# EAGLE design modEEGamp_v1.1 (EAGLE 4.09)
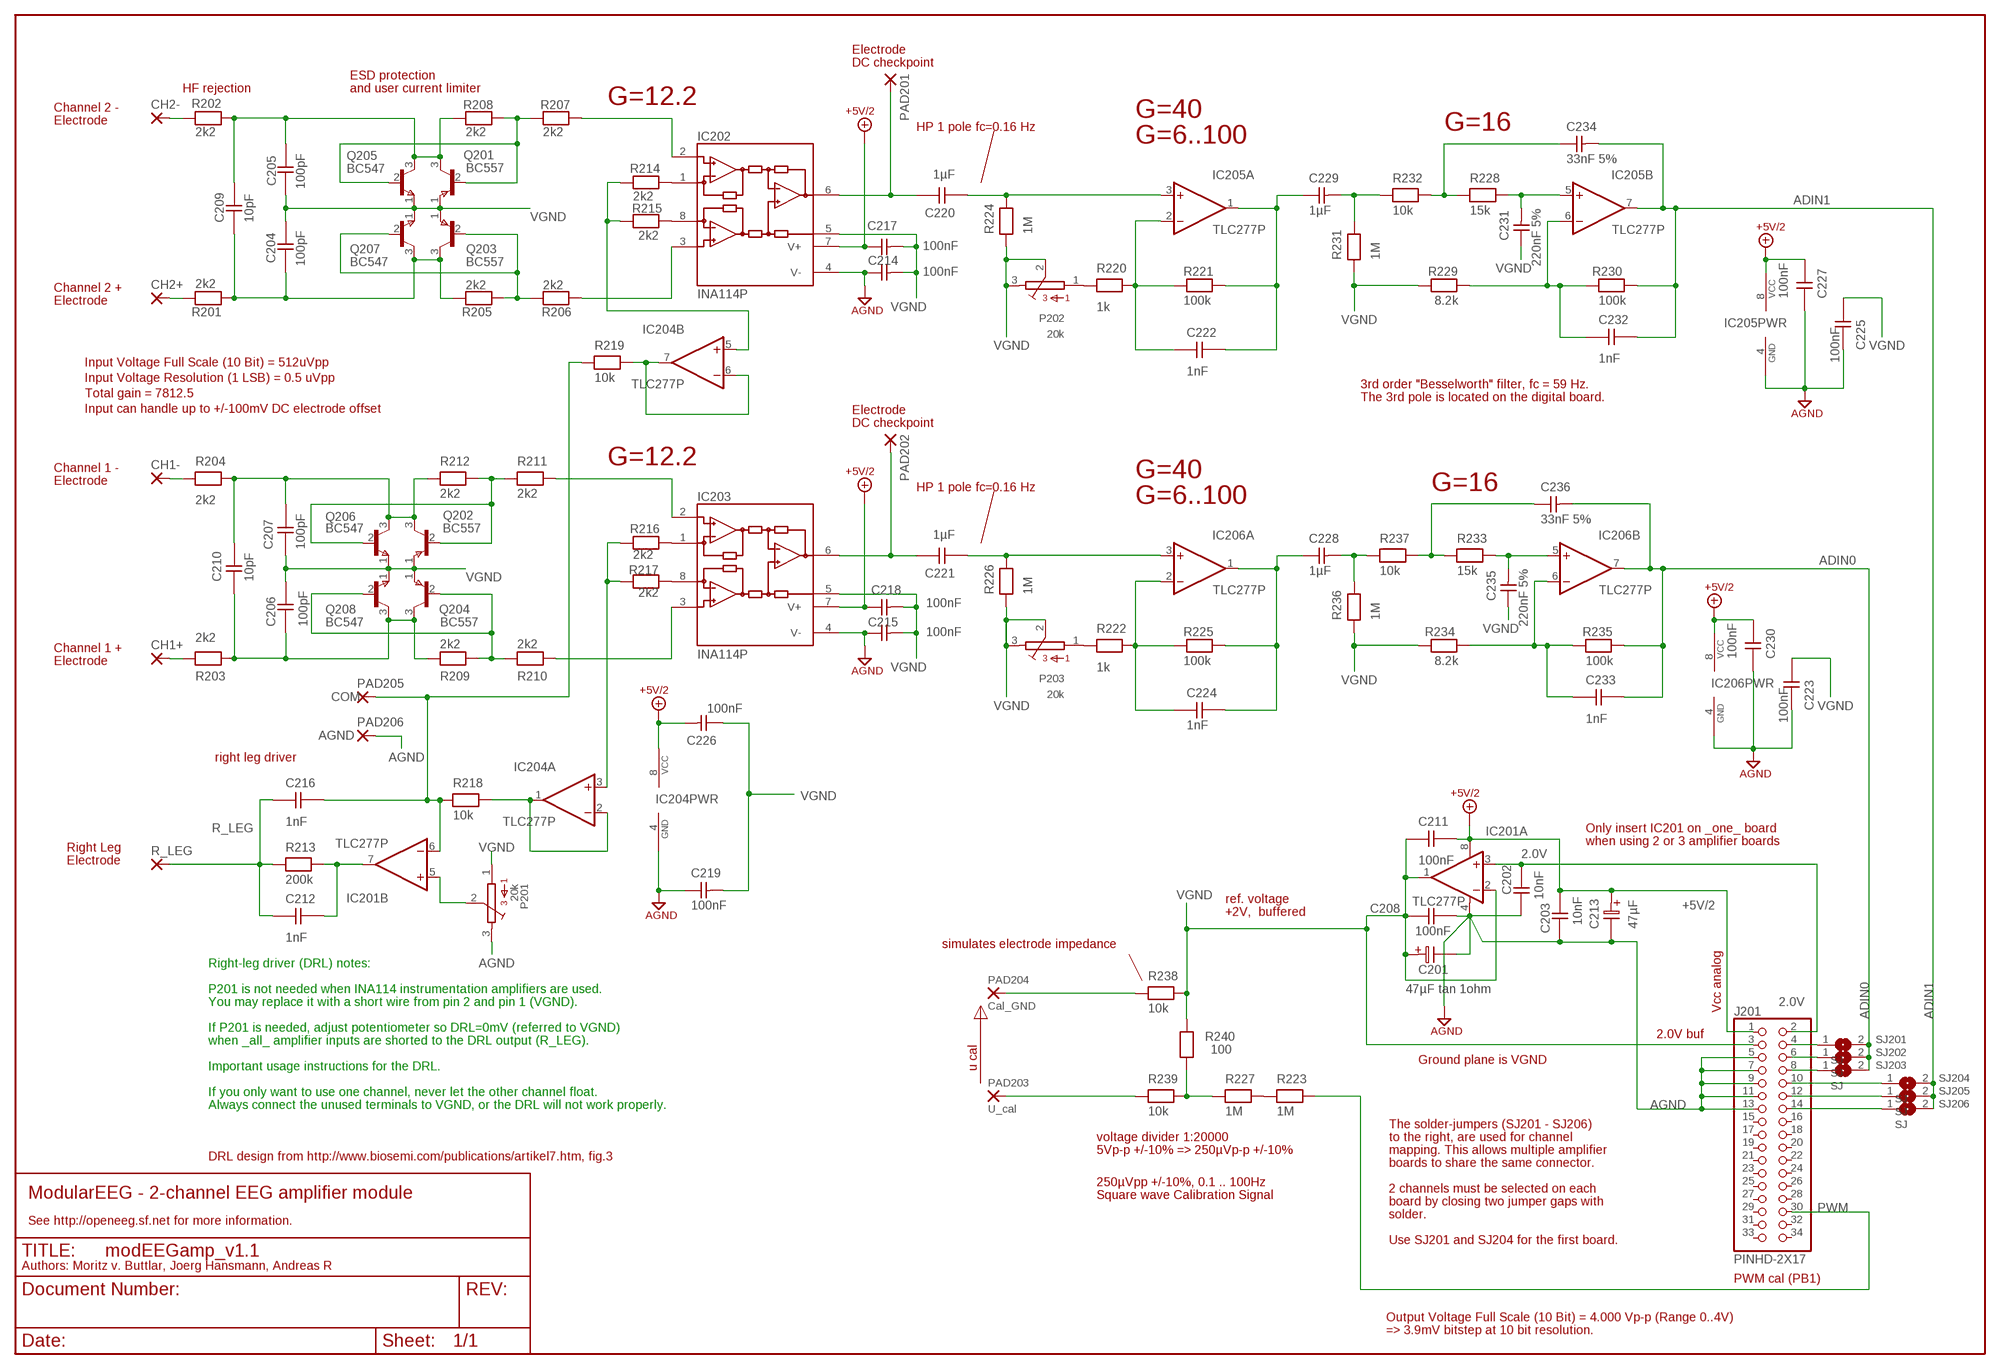
[diagram p0: schematic, sheet 1]

## Parts
C201  47µF tan 1ohm  ELC-2,5  [EL25B]
C202  10nF  CAPNP-5@2  [C-5]
C203  10nF  CAPNP-7,5  [C-5]
C204  100pF  CAPNP-7,5  [C-5]
C205  100pF  CAPNP-7,5  [C-5]
C206  100pF  CAPNP-7,5  [C-5]
C207  100pF  CAPNP-7,5  [C-5]
C208  100nF  CAPNP-7,5  [C-5]
C209  10pF  CAPNP-7,5  [C-5]
C210  10pF  CAPNP-7,5  [C-5]
C211  100nF  CAPNP-5@2  [C-5]
C212  1nF  CAPNP-7,5  [C-5]
C213  47µF  ELC-5  [EL25B]
C214  100nF  CAPNP-5  [C-5]
C215  100nF  CAPNP-5  [C-5]
C216  1nF  CAPNP-7,5  [C-5]
C217  100nF  CAPNP-5  [C-5]
C218  100nF  CAPNP-5  [C-5]
C219  100nF  CAPNP-5  [C-5]
C220  1µF  CAPNP-7,5@2  [C-10]
C221  1µF  CAPNP-7,5@2  [C-10]
C222  1nF  CAPNP-7,5  [C-5]
C223  100nF  CAPNP-5@2  [C-5]
C224  1nF  CAPNP-7,5  [C-5]
C225  100nF  CAPNP-5@2  [C-5]
C226  100nF  CAPNP-5  [C-5]
C227  100nF  CAPNP-5@2  [C-5]
C228  1µF  CAPNP-7,5@3  [C-10]
C229  1µF  CAPNP-7,5@3  [C-10]
C230  100nF  CAPNP-5@2  [C-5]
C231  220nF 5%  CAPNP-5  [C-5]
C232  1nF  CAPNP-7,5  [C-5]
C233  1nF  CAPNP-7,5  [C-5]
C234  33nF 5%  CAPNP-5  [C-5]
C235  220nF 5%  CAPNP-5  [C-5]
C236  33nF 5%  CAPNP-5  [C-5]
CH1+  1,6/0,8  [1,6/0,8]
CH1-  1,6/0,8  [1,6/0,8]
CH2+  1,6/0,8  [1,6/0,8]
CH2-  1,6/0,8  [1,6/0,8]
IC201  TLC277P  OPA2604AP  [DIL-08]
IC202  INA114P  [DIL-08]
IC203  INA114P  [DIL-08]
IC204  TLC277P  [DIL-08]
IC205  TLC277P  [DIL-08]
IC206  TLC277P  [DIL-08]
J201  PINHD-2X17  [2X17]
P201  20k  S64Y  [S64Y]
P202  20k  S64Y  [S64Y]
P203  20k  S64Y  [S64Y]
PAD201  1,6/0,8  [1,6/0,8]
PAD202  1,6/0,8  [1,6/0,8]
PAD203  U_cal  1,6/0,8  [WIREPAD1]
PAD204  Cal_GND  1,6/0,8  [WIREPAD1]
PAD205  COM  1,6/0,8  [1,6/0,8]
PAD206  AGND  1,6/0,8  [1,6/0,8]
Q201  BC557  [TO92]
Q202  BC557  [TO92]
Q203  BC557  [TO92]
Q204  BC557  [TO92]
Q205  BC547  [TO92]
Q206  BC547  [TO92]
Q207  BC547  [TO92]
Q208  BC547  [TO92]
R201  2k2  RESEU-10  [R-10]
R202  2k2  RESEU-10  [R-10]
R203  2k2  RESEU-10  [R-10]
R204  2k2  RESEU-10  [R-10]
R205  2k2  RESEU-10  [R-10]
R206  2k2  RESEU-10  [R-10]
R207  2k2  RESEU-10  [R-10]
R208  2k2  RESEU-10  [R-10]
R209  2k2  RESEU-10  [R-10]
R210  2k2  RESEU-10  [R-10]
R211  2k2  RESEU-10  [R-10]
R212  2k2  RESEU-10  [R-10]
R213  200k  RESEU-10  [R-10]
R214  2k2  RESEU-7,5  [R-10]
R215  2k2  RESEU-7,5  [R-10]
R216  2k2  RESEU-7,5  [R-10]
R217  2k2  RESEU-7,5  [R-10]
R218  10k  RESEU-10  [R-10]
R219  10k  RESEU-10@2  [R-10]
R220  1k  RESEU-7,5  [R-10]
R221  100k  RESEU-7,5  [R-10]
R222  1k  RESEU-7,5  [R-10]
R223  1M  RESEU-10@2  [R-10]
R224  1M  RESEU-7,5  [R-10]
R225  100k  RESEU-7,5  [R-10]
R226  1M  RESEU-7,5  [R-10]
R227  1M  RESEU-10@2  [R-10]
R228  15k  RESEU-7,5@2  [R-10]
R229  8.2k  RESEU-7,5  [R-10]
R230  100k  RESEU-7,5  [R-10]
R231  1M  RESEU-7,5  [R-10]
R232  10k  RESEU-7,5@2  [R-10]
R233  15k  RESEU-7,5@2  [R-10]
R234  8.2k  RESEU-7,5  [R-10]
R235  100k  RESEU-7,5  [R-10]
R236  1M  RESEU-7,5  [R-10]
R237  10k  RESEU-7,5@2  [R-10]
R238  10k  RESEU-7,5  [R-10]
R239  10k  RESEU-7,5  [R-10]
R240  100  RESEU-7,5  [R-10]
R_LEG  1,6/0,8  [1,6/0,8]
SJ201  SJ  [SJ5X5]
SJ202  SJ  [SJ5X5]
SJ203  SJ  [SJ5X5]
SJ204  SJ  [SJ5X5]
SJ205  SJ  [SJ5X5]
SJ206  SJ  [SJ5X5]

## Nets
2.0V: C202.1 IC201.3(A:+IN) J201.2
+5V/2: C203.1 C211.2 C213.1 C217.1 C218.1 C226.2 C227.2 C230.2 IC201.8(A:V+) IC202.7(V+) IC203.7(V+) IC204.8(PWR:VCC) IC205.8(PWR:VCC) IC206.8(PWR:VCC) J201.1
ADIN0: C233.2 C236.2 IC206.7(B:OUT) R235.2 SJ201.2 SJ202.2 SJ203.2
ADIN1: C232.2 C234.2 IC205.7(B:OUT) R230.2 SJ204.2 SJ205.2 SJ206.2
AGND: C201.2 C202.2 C203.2 C208.2 C213.2 C214.1 C215.1 C219.1 C223.1 C225.1 C227.1 C230.1 IC201.4(A:V-) IC202.4(V-) IC203.4(V-) IC204.4(PWR:GND) IC205.4(PWR:GND) IC206.4(PWR:GND) J201.5 J201.7 J201.9 J201.11 J201.13 P201.3 PAD206.1(P)
N$1: IC202.1(RG) R214.1
N$2: IC202.8(RG) R215.1
N$3: IC204.5(B:+IN) R214.2 R215.2
N$4: C220.2 IC202.6(OUT) PAD201.1(P)
N$5: IC202.2(-IN) R207.2
N$6: CH1-.1(P) R204.1
N$7: IC202.3(+IN) R206.2
N$8: Q201.2(B) Q205.2(B) R207.1 R208.2
N$9: C205.2 C209.2 Q201.3(C) Q205.3(C) R202.2 R208.1
N$10: Q203.2(B) Q207.2(B) R205.2 R206.1
N$11: CH1+.1(P) R203.1
N$12: IC204.3(A:+IN) R216.2 R217.2
N$13: C204.1 C209.1 Q203.3(C) Q207.3(C) R201.2 R205.1
N$14: IC203.1(RG) R216.1
N$15: CH2-.1(P) R202.1
N$16: CH2+.1(P) R201.1
N$17: C220.1 IC205.3(A:+IN) R224.2
N$18: C222.1 IC205.2(A:-IN) R220.2 R221.1
N$19: P202.1 R220.1
N$20: IC203.8(RG) R217.1
N$21: IC203.2(-IN) R211.2
N$22: C222.2 C229.1 IC205.1(A:OUT) R221.2
N$23: C229.2 R231.2 R232.1
N$24: C232.1 IC205.6(B:-IN) R229.2 R230.1
N$25: C221.2 IC203.6(OUT) PAD202.1(P)
N$26: J201.4 SJ201.1
N$27: IC203.3(+IN) R210.2
N$28: C221.1 IC206.3(A:+IN) R226.2
N$29: Q202.2(B) Q206.2(B) R211.1 R212.2
N$30: PAD204.1(P) R238.1
N$31: J201.6 SJ202.1
N$32: C207.2 C210.2 Q202.3(C) Q206.3(C) R204.2 R212.1
N$33: C212.2 IC201.7(B:OUT) R213.2
N$34: R227.1 R239.2 R240.2
N$35: J201.8 SJ203.1
N$36: J201.10 SJ204.1
N$37: J201.12 SJ205.1
N$38: C224.1 IC206.2(A:-IN) R222.2 R225.1
N$39: Q204.2(B) Q208.2(B) R209.2 R210.1
N$40: P203.1 R222.1
N$41: C216.2 IC201.6(B:-IN) PAD205.1(P) R218.1 R219.1
N$42: C224.2 C228.1 IC206.1(A:OUT) R225.2
N$43: C206.1 C210.1 Q204.3(C) Q208.3(C) R203.2 R209.1
N$44: J201.14 SJ206.1
N$45: IC204.6(B:-IN) IC204.7(B:OUT) R219.2
N$46: R223.1 R227.2
N$47: IC201.5(B:+IN) P201.2
N$48: PAD203.1(P) R239.1
N$49: C233.1 IC206.6(B:-IN) R234.2 R235.1
N$50: C228.2 R236.2 R237.1
N$51: C236.1 R233.1 R237.2
N$52: IC204.1(A:OUT) IC204.2(A:-IN) R218.2
N$53: C234.1 R228.1 R232.2
N$54: C231.2 IC205.5(B:+IN) R228.2
N$57: C235.2 IC206.5(B:+IN) R233.2
PWM: J201.30 R223.2
R_LEG: C212.1 C216.1 R213.1 R_LEG.1(P)
VGND: C201.1 C204.2 C205.1 C206.2 C207.1 C208.1 C211.1 C214.2 C215.2 C217.2 C218.2 C219.2 C223.2 C225.2 C226.1 C231.1 C235.1 IC201.1(A:OUT) IC201.2(A:-IN) IC202.5(REF) IC203.5(REF) J201.3 P201.1 P202.2 P202.3 P203.2 P203.3 Q201.1(E) Q202.1(E) Q203.1(E) Q204.1(E) Q205.1(E) Q206.1(E) Q207.1(E) Q208.1(E) R224.1 R226.1 R229.1 R231.1 R234.1 R236.1 R238.2 R240.1
Unconnected: J201.15 J201.16 J201.17 J201.18 J201.19 J201.20 J201.21 J201.22 J201.23 J201.24 J201.25 J201.26 J201.27 J201.28 J201.29 J201.31 J201.32 J201.33 J201.34

## Notes on the sheet
- Electrode
- DC checkpoint
- ESD protection
- HF rejection | and user current limiter
- G=12.2
- Channel 2 -
- G=40
- Electrode
- HP 1 pole fc=0.16 Hz | G=16
- G=6..100
- Channel 2 +
- Electrode
- Input Voltage Full Scale (10 Bit) = 512uVpp
- Input Voltage Resolution (1 LSB) = 0.5 uVpp
- 3rd order "Besselworth" filter, fc = 59 Hz.
- Total gain = 7812.5
- The 3rd pole is located on the digital board.
- Input can handle up to +/-100mV DC electrode offset | Electrode
- DC checkpoint
- G=12.2
- Channel 1 -
- G=40
- Electrode
- HP 1 pole fc=0.16 Hz | G=16
- G=6..100
- Channel 1 +
- Electrode
- right leg driver
- Only insert IC201 on _one_ board
- when using 2 or 3 amplifier boards
- Right Leg
- Electrode
- ref. voltage
- +2V,  buffered
- simulates electrode impedance
- Right-leg driver (DRL) notes:
- P201 is not needed when INA114 instrumentation amplifiers are used.
- You may replace it with a short wire from pin 2 and pin 1 (VGND).
- Vcc analog
- If P201 is needed, adjust potentiometer so DRL=0mV (referred to VGND)
- 2.0V buf
- when _all_ amplifier inputs are shorted to the DRL output (R_LEG). | u cal
- Ground plane is VGND
- Important usage instructions for the DRL.
- If you only want to use one channel, never let the other channel float.
- Always connect the unused terminals to VGND, or the DRL will not work properly.
- The solder-jumpers (SJ201 - SJ206)
- voltage divider 1:20000 | to the right, are used for channel
- 5Vp-p +/-10% => 250µVp-p +/-10% | mapping. This allows multiple amplifier
- DRL design from http://www.biosemi.com/publications/artikel7.htm, fig.3
- boards to share the same connector.
- 250µVpp +/-10%, 0.1 .. 100Hz
- 2 channels must be selected on each
- ModularEEG - 2-channel EEG amplifier module | Square wave Calibration Signal
- board by closing two jumper gaps with
- solder.
- See http://openeeg.sf.net for more information.
- Use SJ201 and SJ204 for the first board.
- Authors: Moritz v. Buttlar, Joerg Hansmann, Andreas R
- PWM cal (PB1)
- Output Voltage Full Scale (10 Bit) = 4.000 Vp-p (Range 0..4V)
- => 3.9mV bitstep at 10 bit resolution.

## Library data of the parts
C201 = DISCRETE@3:ELC-2,5
C202 C211 C223 C225 C227 C230 = DISCRETE:CAPNP-5@2
C203-C210 C212 C216 C222 C224 C232 C233 = DISCRETE:CAPNP-7,5
C213 = DISCRETE@2:ELC-5
C214 C215 C217-C219 C226 C231 C234-C236 = DISCRETE:CAPNP-5
C220 C221 = DISCRETE:CAPNP-7,5@2
C228 C229 = DISCRETE:CAPNP-7,5@3
CH1+ CH1- CH2+ CH2- PAD201 PAD202 PAD205 PAD206 R_LEG = WIREPAD:1,6/0,8: THROUGH-HOLE PAD
IC201 = BURR:OPA2604AP
IC202 IC203 = BURR:INA114P
IC204-IC206 = BURR:TLC277P
J201 = pinhead_:PINHD-2X17
P201 = TRIMPOT:S64Y
P202 P203 = TRIMPOT@2:S64Y
PAD203 PAD204 = WIREPAD@2:1,6/0,8
Q201-Q204 = pnp:BC557
Q205-Q208 = NPN:BC547
R201-R213 R218 = DISCRETE:RESEU-10
R214-R217 R220-R222 R224-R226 R229-R231 R234-R236 R238-R240 = DISCRETE:RESEU-7,5
R219 R223 R227 = DISCRETE:RESEU-10@2
R228 R232 R233 R237 = DISCRETE:RESEU-7,5@2
SJ201-SJ206 = JUMPER:SJ

## Board
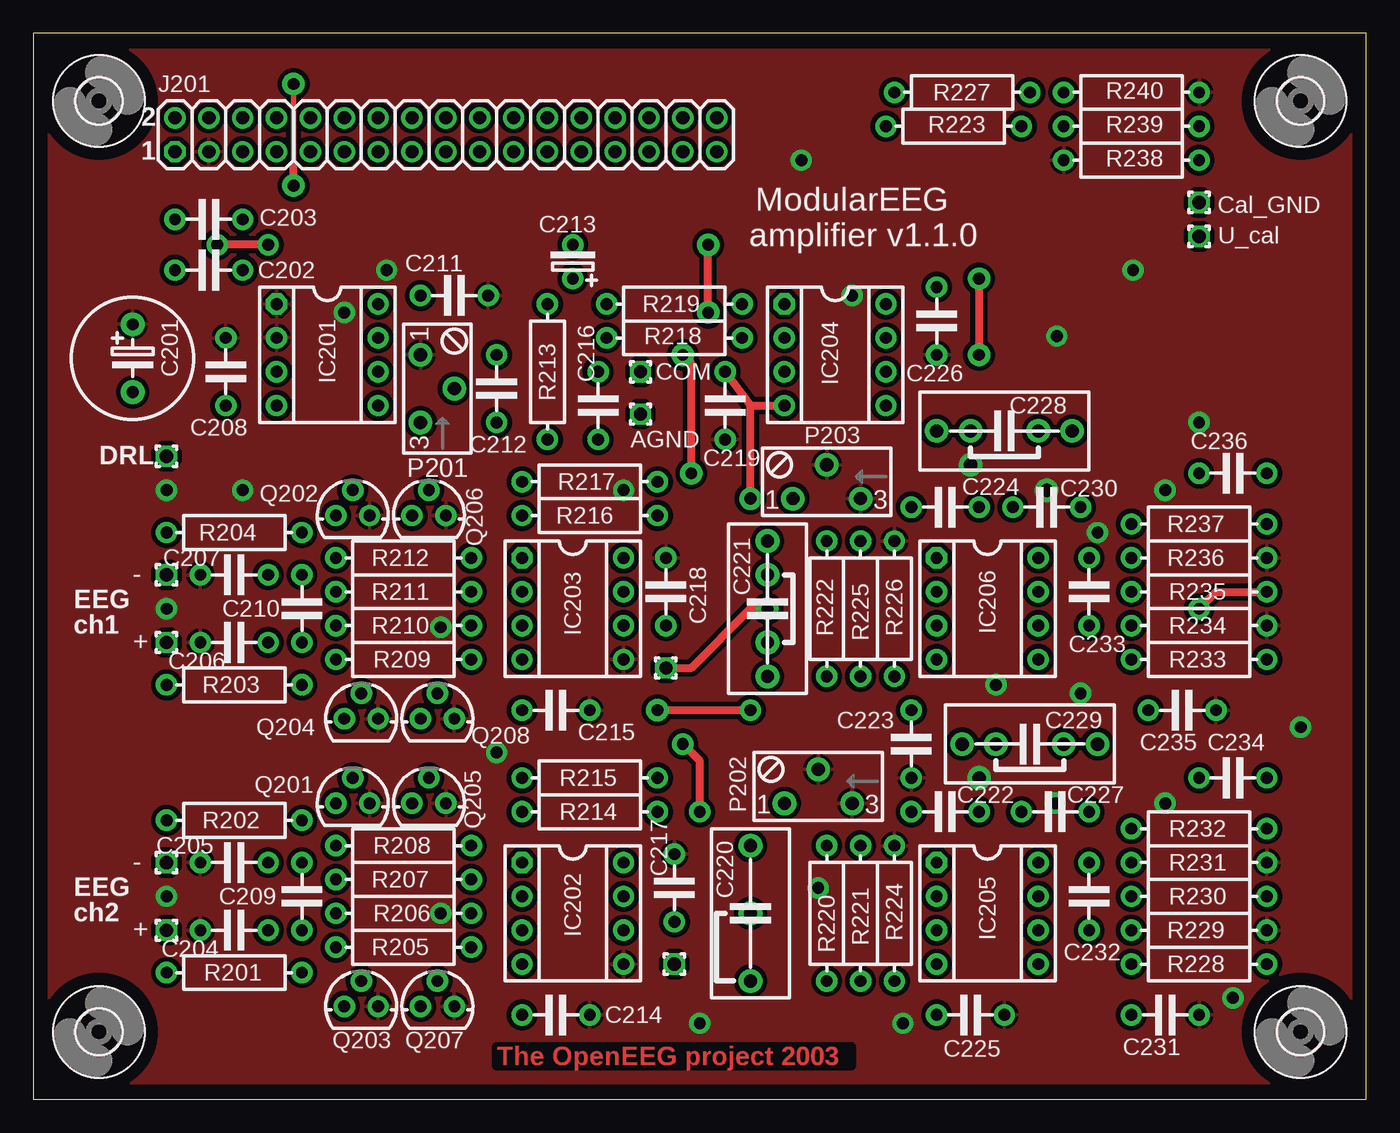
[diagram p1: board, top side]
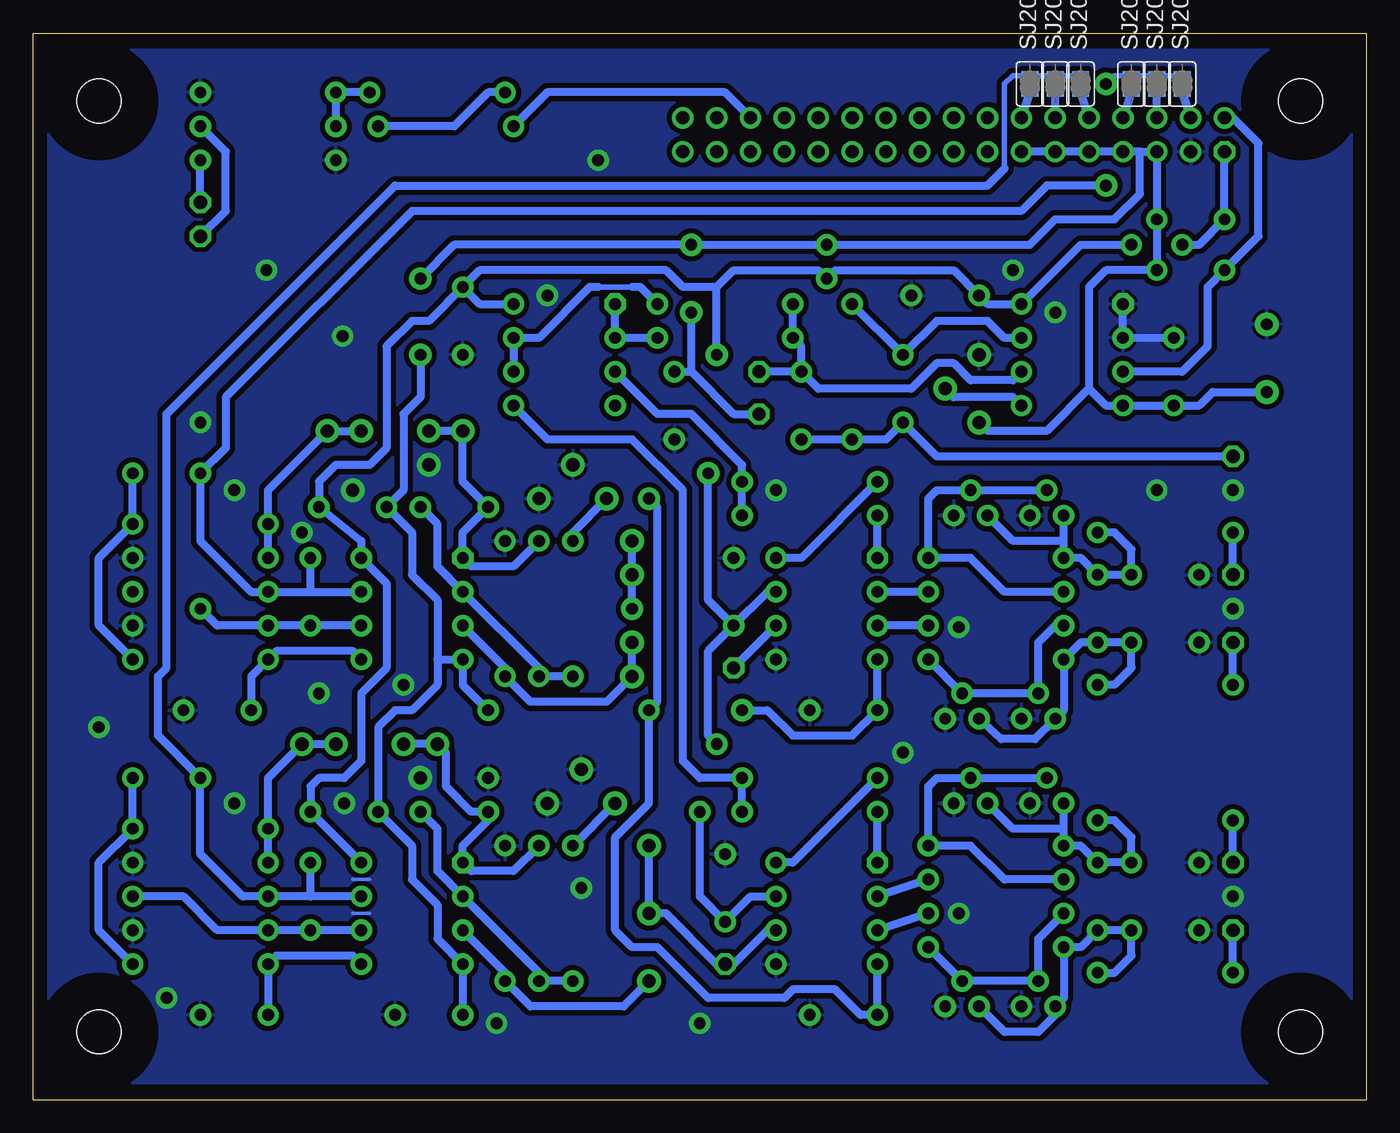
[diagram p2: board, bottom side, seen from below]

Size 100 x 80.01 mm. Coordinates in mm from the lower left corner, seen from the top.
Outline: 100,0.01 100,80.01 0,80.01 0,0.01
Outline: 100,0 0,0
Copper layers used: Top, Bottom

### Footprints (pad centres in the part's own frame; a part is rotated, then mirrored left to right if it is on the bottom)
ES-5 = drill 0.889 pad 1.778 round: 1 -2.54,0; 2 2.54,0
C-5 = drill 0.889 pad 1.6 round: 1 -2.54,0; 2 2.54,0
EL25B = drill 0.889 pad 1.6 round: 1 -1.27,0; 2 1.27,0
C-10 = drill 0.991 pad 1.778 round: 1 -5.08,0; 2 5.08,0
WIREPAD1 = drill 0.991 pad 1.6 octagon: 1 0,0
DIL-08 = drill 0.889 pad 1.6 octagon: 1 -3.81,-3.81 | drill 0.889 pad 1.6 round: 2 -1.27,-3.81; 3 1.27,-3.81; 4 3.81,-3.81; 5 3.81,3.81; 6 1.27,3.81; 7 -1.27,3.81; 8 -3.81,3.81
2X17 = drill 0.991 pad 1.6 octagon: 1 -20.32,-1.27 | drill 0.991 pad 1.6 round: 2 -20.32,1.27; 3 -17.78,-1.27; 4 -17.78,1.27; 5 -15.24,-1.27; 6 -15.24,1.27; 7 -12.7,-1.27; 8 -12.7,1.27; 9 -10.16,-1.27; 10 -10.16,1.27; 11 -7.62,-1.27; 12 -7.62,1.27; 13 -5.08,-1.27; 14 -5.08,1.27; 15 -2.54,-1.27; 16 -2.54,1.27; 17 0,-1.27; 18 0,1.27; 19 2.54,-1.27; 20 2.54,1.27; 21 5.08,-1.27; 22 5.08,1.27; 23 7.62,-1.27; 24 7.62,1.27; 25 10.16,-1.27; 26 10.16,1.27; 27 12.7,-1.27; 28 12.7,1.27; 29 15.24,-1.27; 30 15.24,1.27; 31 17.78,-1.27; 32 17.78,1.27; 33 20.32,-1.27; 34 20.32,1.27
S64Y = drill 0.991 pad 1.778 round: 1 2.54,1.27; 2 0,-1.27; 3 -2.54,1.27
TO92 = drill 0.889 pad 1.6 round: 1 1.27,0; 2 0,1.905; 3 -1.27,0
R-10 = drill 0.889 pad 1.6 round: 1 -5.08,0; 2 5.08,0
SJ5X5 = smd 0.635 x 1.27: 1 -0.635,0; 2 0.635,0
3,3 = hole 3.3: 0,0

### Placement (x,y rotation side)
C201  47µF tan 1ohm  [ES-5]  7.46,55.64 270 top
C202  13.17,62.24 0 top
C203  13.17,66.05 0 top
C204  15.08,12.71 180 top
C205  15.08,17.79 0 top
C206  15.08,34.3 180 top
C207  15.08,39.38 0 top
C208  14.44,54.62 270 top
C209  20.15,15.25 90 top
C210  20.15,36.84 90 top
C211  31.58,60.34 180 top
C212  34.76,53.35 90 top
C213  40.48,62.88 90 top
C214  39.2,6.36 0 top
C215  39.2,29.22 0 top
C216  42.38,52.08 90 top
C217  48.09,15.88 90 top
C218  47.46,38.11 90 top
C219  51.91,52.08 270 top
C220  53.81,13.98 90 top
C221  55.08,36.84 90 top
C222  68.41,21.6 180 top
C223  65.88,26.68 270 top
C224  68.41,44.46 180 top
C225  70.32,6.36 0 top
C226  67.78,58.43 90 top
C227  76.67,21.6 0 top
C228  72.86,50.17 0 top
C229  74.77,26.68 0 top
C230  76.03,44.46 0 top
C231  84.92,6.36 180 top
C232  79.21,15.25 90 top
C233  79.21,38.11 90 top
C234  90,24.14 180 top
C235  86.19,29.22 180 top
C236  90,47 180 top
CH1+  [WIREPAD1]  10,34.3 90 top
CH1-  [WIREPAD1]  10,39.38 90 top
CH2+  [WIREPAD1]  10,12.71 0 top
CH2-  [WIREPAD1]  10,17.79 0 top
IC201  22.06,55.89 270 top
IC202  40.48,13.98 270 top
IC203  40.48,36.84 270 top
IC204  60.16,55.89 270 top
IC205  71.59,13.98 270 top
IC206  71.59,36.84 270 top
J201  30.95,72.4 0 top
P201  30.31,53.35 90 top
P202  58.89,23.51 180 top
P203  59.52,46.36 180 top
PAD201  [WIREPAD1]  48.09,10.17 270 top
PAD202  [WIREPAD1]  47.46,32.39 270 top
PAD203  87.47,64.78 0 top
PAD204  87.47,67.32 0 top
PAD205  COM  [WIREPAD1]  45.55,54.62 0 top
PAD206  AGND  [WIREPAD1]  45.55,51.45 0 top
Q201  23.96,22.24 0 top
Q202  23.96,43.82 0 top
Q203  24.6,7 0 top
Q204  24.6,28.59 0 top
Q205  29.68,22.24 0 top
Q206  29.68,43.82 0 top
Q207  30.31,7 0 top
Q208  30.31,28.59 0 top
R201  15.08,9.54 0 top
R202  15.08,20.96 0 top
R203  15.08,31.12 0 top
R204  15.08,42.55 0 top
R205  27.77,11.44 0 top
R206  27.77,13.98 0 top
R207  27.77,16.52 0 top
R208  27.77,19.06 0 top
R209  27.77,33.03 0 top
R210  27.77,35.57 0 top
R211  27.77,38.11 0 top
R212  27.77,40.65 0 top
R213  38.57,54.62 90 top
R214  41.74,21.6 0 top
R215  41.74,24.14 0 top
R216  41.74,43.82 0 top
R217  41.74,46.36 0 top
R218  48.09,57.16 0 top
R219  48.09,59.7 0 top
R220  59.52,13.98 270 top
R221  62.06,13.98 90 top
R222  59.52,36.84 270 top
R223  69.05,73.04 180 top
R224  64.61,13.98 270 top
R225  62.06,36.84 90 top
R226  64.61,36.84 270 top
R227  69.69,75.58 180 top
R228  87.47,10.17 180 top
R229  87.47,12.71 180 top
R230  87.47,15.25 180 top
R231  87.47,17.79 180 top
R232  87.47,20.33 0 top
R233  87.47,33.03 180 top
R234  87.47,35.57 180 top
R235  87.47,38.11 180 top
R236  87.47,40.65 180 top
R237  87.47,43.19 0 top
R238  82.39,70.5 180 top
R239  82.39,73.04 180 top
R240  82.39,75.58 180 top
R_LEG  [WIREPAD1]  10,48.27 0 top
SJ201  13.81,76.21 90 bottom
SJ202  15.71,76.21 90 bottom
SJ203  17.61,76.21 90 bottom
SJ204  21.42,76.21 90 bottom
SJ205  23.33,76.21 90 bottom
SJ206  25.23,76.21 90 bottom
U$10  [3,3]  95.08,74.94 0 top
U$11  [3,3]  4.92,5.09 0 top
U$12  [3,3]  95.08,5.09 0 top
U$13  [3,3]  4.92,74.94 0 top

### Tracks (layer width: path | path; a pad name or v marks a point on that pad's centre or on a via)
2.0V
  Bottom 0.61: J201.2 10,73.67 8.09,71.77 8.09,64.78 C202.1 11.9,60.97 11.9,56.52 13.81,54.62 IC201.3
+5V/2  (via drill 0.89 pad 1.6, 0.89 pad 1.68)
  Top 0.61: v17.61,64.15 v13.81,64.15 | v49.37,47 49.37,55.25 v48.73,55.89 | v50,21.6 50,25.41 v48.73,26.68
  Bottom 0.61: IC202.7 46.19,15.25 C217.1 50,15.25 v50,21.6 | C218.1 49.37,33.66 49.37,27.32 v48.73,26.68 | IC203.7 44.92,38.11 C218.1 | C218.1 49.37,37.48 v49.37,47 | IC205.8 C227.2 79.21,23.51 78.58,24.14 76.67,24.14 75.4,25.41 75.4,30.49 73.5,32.39 73.5,38.74 IC206.8 75.4,41.92 C230.2 78.58,46.36 77.3,47.63 74.77,47.63 73.5,48.91 73.5,56.52 71.59,58.43 70.32,58.43 C226.2 | C226.2 66.51,62.24 52.54,62.24 51.27,60.97 48.73,60.97 | C226.2 66.51,59.7 IC204.8 | 48.73,60.97 47.46,62.24 41.11,62.24 C213.1 39.84,62.24 30.95,62.24 C211.2 28.41,59.7 IC201.8 21.42,64.15 v17.61,64.15 | J201.1 C203.1 12.54,64.15 v13.81,64.15 | v48.73,55.89 48.73,60.97
ADIN0  (via drill 0.89 pad 1.68)
  Top 0.406: 19.52,69.86 v19.52,76.21
  Top 0.61: v19.52,68.59 19.52,69.86
  Bottom 0.406: v19.52,76.21 18.88,76.84 SJ203.2 SJ202.2 SJ201.2
  Bottom 0.61: v19.52,68.59 23.96,68.59 25.87,66.69 71.59,66.69 85.56,52.71 85.56,48.91 C236.2 87.47,41.92 83.66,38.11 R235.2 79.21,38.11 | 79.21,38.11 IC206.7 | 79.21,38.11 C233.2
ADIN1
  Bottom 0.406: 27.14,69.86 27.14,76.21 26.5,76.84 SJ206.2 SJ205.2 SJ204.2
  Bottom 0.61: 27.14,69.86 28.41,68.59 72.86,68.59 90,51.45 90,32.39 90.64,31.76 90.64,27.32 C234.2 87.47,18.43 84.29,15.25 R230.2 79.21,15.25 | IC205.7 79.21,15.25 | 79.21,15.25 C232.2
AGND  (via drill 0.89 pad 1.6, 0.89 pad 1.68)
  Top 0.61: v53.81,29.22 v46.82,29.22 | v70.95,61.6 v70.95,55.89 | v53.81,45.09 53.81,52.08 | 53.81,52.08 IC204.4 | 53.81,52.08 C219.1 | v50.63,59.06 v50.63,64.15
  Bottom 0.61: IC203.4 C215.1 38.57,27.32 43.02,27.32 44.92,29.22 v46.82,29.22 | IC202.4 C214.1 37.94,6.36 39.84,8.27 43.02,8.27 43.65,7.63 49.37,7.63 53.17,11.44 55.08,11.44 56.35,12.71 56.35,19.7 53.81,22.24 v53.81,29.22 53.17,29.86 53.17,44.46 v53.81,45.09 | C225.1 IC205.4 69.69,12.07 69.69,14.62 71.59,16.52 71.59,19.06 C227.1 74.13,27.95 72.86,29.22 71.59,29.22 69.69,31.12 69.69,33.03 | 69.69,33.03 69.69,37.48 71.59,39.38 71.59,42.55 C230.1 72.22,45.73 72.22,51.45 70.95,52.71 v70.95,55.89 | 69.69,33.03 IC206.4 67.78,31.12 C223.1 | 16.98,71.13 J201.5 C203.2 C202.2 19.52,62.24 20.79,60.97 20.79,53.35 | 16.98,71.13 J201.7 J201.9 J201.11 J201.13 | v70.95,61.6 68.41,64.15 v50.63,64.15 C213.2 25.23,64.15 23.33,66.05 18.88,66.05 16.98,67.95 16.98,71.13 | C219.1 50.63,54.62 | 50.63,54.62 v50.63,59.06 | C201.2 11.52,53.1 12.54,52.08 C208.2 IC201.4 19.52,52.08 20.79,53.35 | P201.3 28.41,50.17 23.96,50.17 20.79,53.35 | PAD206.1 47.46,51.45 50.63,54.62
N$1
  Bottom 0.61: IC202.1 R214.1
N$2
  Bottom 0.61: IC202.8 43.02,17.79 R215.1
N$3
  Bottom 0.61: R214.2 R215.2 50,24.14 51.27,25.41 51.27,45.73 55.08,49.54 61.43,49.54 IC204.5
N$4  (via drill 0.99 pad 1.78)
  Bottom 0.61: IC202.6 44.92,12.71 47.46,10.17 PAD201.1 48.73,10.17 52.54,13.98 v53.81,13.98 C220.2
N$5
  Bottom 0.61: R207.2 IC202.2
N$6
  Bottom 0.61: CH1-.1 R204.1
N$7
  Bottom 0.61: R206.2 IC202.3
N$8
  Bottom 0.61: R207.1 27.14,16.52 29.68,19.06 R208.2 32.85,23.51 32.22,24.14 Q205.2 Q201.2
N$9
  Bottom 0.61: R202.2 18.88,20.96 17.61,19.7 C205.2 C209.2 21.42,19.06 R208.1 22.7,20.33 | 22.7,20.33 Q201.3 | Q205.3 26.5,20.33 22.7,20.33
N$10
  Bottom 0.61: R206.1 24.6,12.07 Q203.2 Q207.2 R205.2
N$11
  Bottom 0.61: R203.1 CH1+.1
N$12
  Bottom 0.61: R216.2 R217.2 46.82,47.63 50.63,51.45 53.17,51.45 IC204.3
N$13
  Bottom 0.61: R201.2 18.88,9.54 17.61,10.8 C204.1 C209.1 21.42,11.44 R205.1 22.7,7.63 Q203.3 23.33,6.36 24.6,5.09 27.14,5.09 Q207.3
N$14
  Bottom 0.61: IC203.1 R216.1
N$15
  Bottom 0.61: CH2-.1 R202.1
N$16
  Bottom 0.61: R201.1 CH2+.1
N$17
  Bottom 0.61: C220.1 55.71,7 62.7,7 R224.2 64.61,9.54 IC205.3
N$18
  Bottom 0.61: R220.2 R221.1 62.06,9.54 IC205.2 69.69,17.16 69.69,20.33 C222.1
N$19
  Bottom 0.61: P202.1 R220.1
N$20
  Bottom 0.61: R217.1 42.38,40.65 IC203.8
N$21
  Bottom 0.61: R211.2 IC203.2
N$22  (via drill 0.99 pad 1.78)
  Bottom 0.61: R221.2 63.97,17.16 67.14,17.16 IC205.1 67.78,19.06 65.88,20.96 C222.2 67.14,21.6 69.05,23.51 69.05,26.05 C229.1 v72.22,26.68
N$23  (via drill 0.99 pad 1.78)
  Bottom 0.61: R231.2 R232.1 82.39,24.14 C229.2 v77.3,26.68
N$24
  Bottom 0.61: IC205.6 C232.1 R229.2 86.19,12.71 88.73,15.25 R230.1
N$25  (via drill 0.89 pad 1.68, 0.99 pad 1.78)
  Top 0.61: PAD202.1 49.37,32.39 53.81,36.84 v55.08,36.84
  Bottom 0.61: PAD202.1 IC203.6 | v55.08,36.84 v55.08,39.38 C221.2
N$26
  Bottom 0.61: J201.4 SJ201.1
N$27
  Bottom 0.61: R210.2 IC203.3
N$28  (via drill 0.99 pad 1.78)
  Bottom 0.61: v55.08,34.3 C221.1 56.98,29.86 62.7,29.86 R226.2 64.61,32.39 IC206.3
N$29
  Bottom 0.61: R211.1 27.14,38.11 29.68,40.65 R212.2 32.85,45.09 32.22,45.73 Q206.2 Q202.2
N$30
  Bottom 0.61: PAD204.1 R238.1
N$31
  Bottom 0.61: J201.6 SJ202.1
N$32
  Bottom 0.61: 22.7,41.92 R212.1 21.42,40.65 C210.2 C207.2 17.61,41.28 18.88,42.55 R204.2 | 22.7,41.92 26.5,41.92 Q206.3 | 22.7,41.92 Q202.3
N$33
  Bottom 0.61: IC201.7 27.14,57.16 28.41,58.43 32.22,58.43 C212.2 R213.2
N$34
  Bottom 0.61: R239.2 R240.2 R227.1
N$35
  Bottom 0.61: SJ203.1 J201.8
N$36
  Bottom 0.61: J201.10 SJ204.1
N$37
  Bottom 0.61: J201.12 SJ205.1
N$38
  Bottom 0.61: R222.2 R225.1 62.06,32.39 IC206.2 69.69,40.02 69.69,43.19 C224.1
N$39
  Bottom 0.61: R210.1 23.33,35.57 24.6,34.3 Q204.2 Q208.2 R209.2
N$40
  Bottom 0.61: P203.1 59.52,42.55 R222.1
N$41
  Bottom 0.61: R219.1 R218.1 42.38,56.52 C216.2 | C216.2 41.11,53.35 34.12,53.35 32.22,55.25 30.95,55.25 29.68,53.98 26.5,53.98 IC201.6 | C216.2 PAD205.1
N$42  (via drill 0.99 pad 1.78)
  Bottom 0.61: v70.32,50.17 C228.1 67.78,46.36 C224.2 67.78,42.55 IC206.1 67.14,40.02 63.97,40.02 R225.2
N$43
  Bottom 0.61: R203.2 18.88,31.12 17.61,32.39 C206.1 C210.1 21.42,34.3 R209.1 22.7,29.22 Q204.3 24.85,27.06 27.39,27.06 Q208.3
N$44
  Bottom 0.61: SJ206.1 J201.14
N$45
  Bottom 0.406: 55.08,60.97 57.62,60.97
  Bottom 0.61: IC204.6 IC204.7 62.06,57.16 58.25,60.97 57.62,60.97 | R219.2 54.45,60.97 55.08,60.97
N$46
  Bottom 0.61: R227.2 65.88,75.58 68.41,73.04 R223.1
N$47
  Bottom 0.61: IC201.5 26.5,52.71 30.95,52.71 P201.2
N$48
  Bottom 0.61: R239.1 85.56,71.13 85.56,66.69 PAD203.1
N$49  (via drill 0.89 pad 1.6)
  Top 0.61: v87.47,36.84 88.73,38.11 R235.1
  Bottom 0.61: IC206.6 C233.1 R234.2 86.19,35.57 v87.47,36.84
N$50  (via drill 0.99 pad 1.78)
  Bottom 0.61: v75.4,50.17 C228.2 82.39,45.73 R237.1 R236.2
N$51
  Bottom 0.61: R233.1 95.08,35.57 95.08,40.65 R237.2 C236.1
N$52
  Bottom 0.61: IC204.1 IC204.2 R218.2
N$53
  Bottom 0.61: R228.1 95.08,12.71 95.08,17.79 R232.2 C234.1
N$54
  Bottom 0.61: IC205.5 76.03,10.8 81.75,10.8 R228.2 C231.2
N$57
  Bottom 0.61: IC206.5 76.03,33.66 81.75,33.66 R233.2 83.66,31.76 C235.2
PWM
  Bottom 0.61: J201.30 48.09,75.58 61.43,75.58 R223.2
R_LEG
  Bottom 0.61: C216.1 R213.1 36.03,49.54 C212.1 32.22,48.27 R_LEG.1
VGND  (via drill 0.89 pad 1.6, 0.99 pad 1.78)
  Bottom 0.254: 76.03,16.52 74.77,16.52 | 74.77,13.98 76.03,13.98
  Bottom 0.61: IC201.1 IC201.2 C208.1
  other vias: 30.57,35.44 30.57,13.98 26.5,62.24 15.71,45.73 44.28,45.73 34.76,26.05 10,36.84 10,15.25 10,45.73 50,5.72 65.24,5.72 58.89,15.88 23.33,59.06 57.62,70.5 78.58,30.49 84.92,45.73 84.92,22.24 87.47,50.81 76.8,57.29 82.51,62.24 72.22,31.12 79.84,42.55 76.03,45.73 70.32,47.63 61.43,60.34 76.67,22.24 70.95,24.14 95.08,27.95 90,7.63
  pour Top (isolate 0.356): 1.1,1.28 1.1,78.75 98.89,78.75 98.89,1.28
  pour Bottom (isolate 0.381): 1.1,78.75 98.89,78.75 98.89,1.28 1.1,1.28

### Text on the board
Top: The OpenEEG project 2003
tNames: 2 | 1 | ModularEEG | amplifier v1.1.0 | DRL | - | EEG | ch1 | + | - | EEG | ch2 | +